# Altium project ACSR-RC-V2.0.PrjPcb
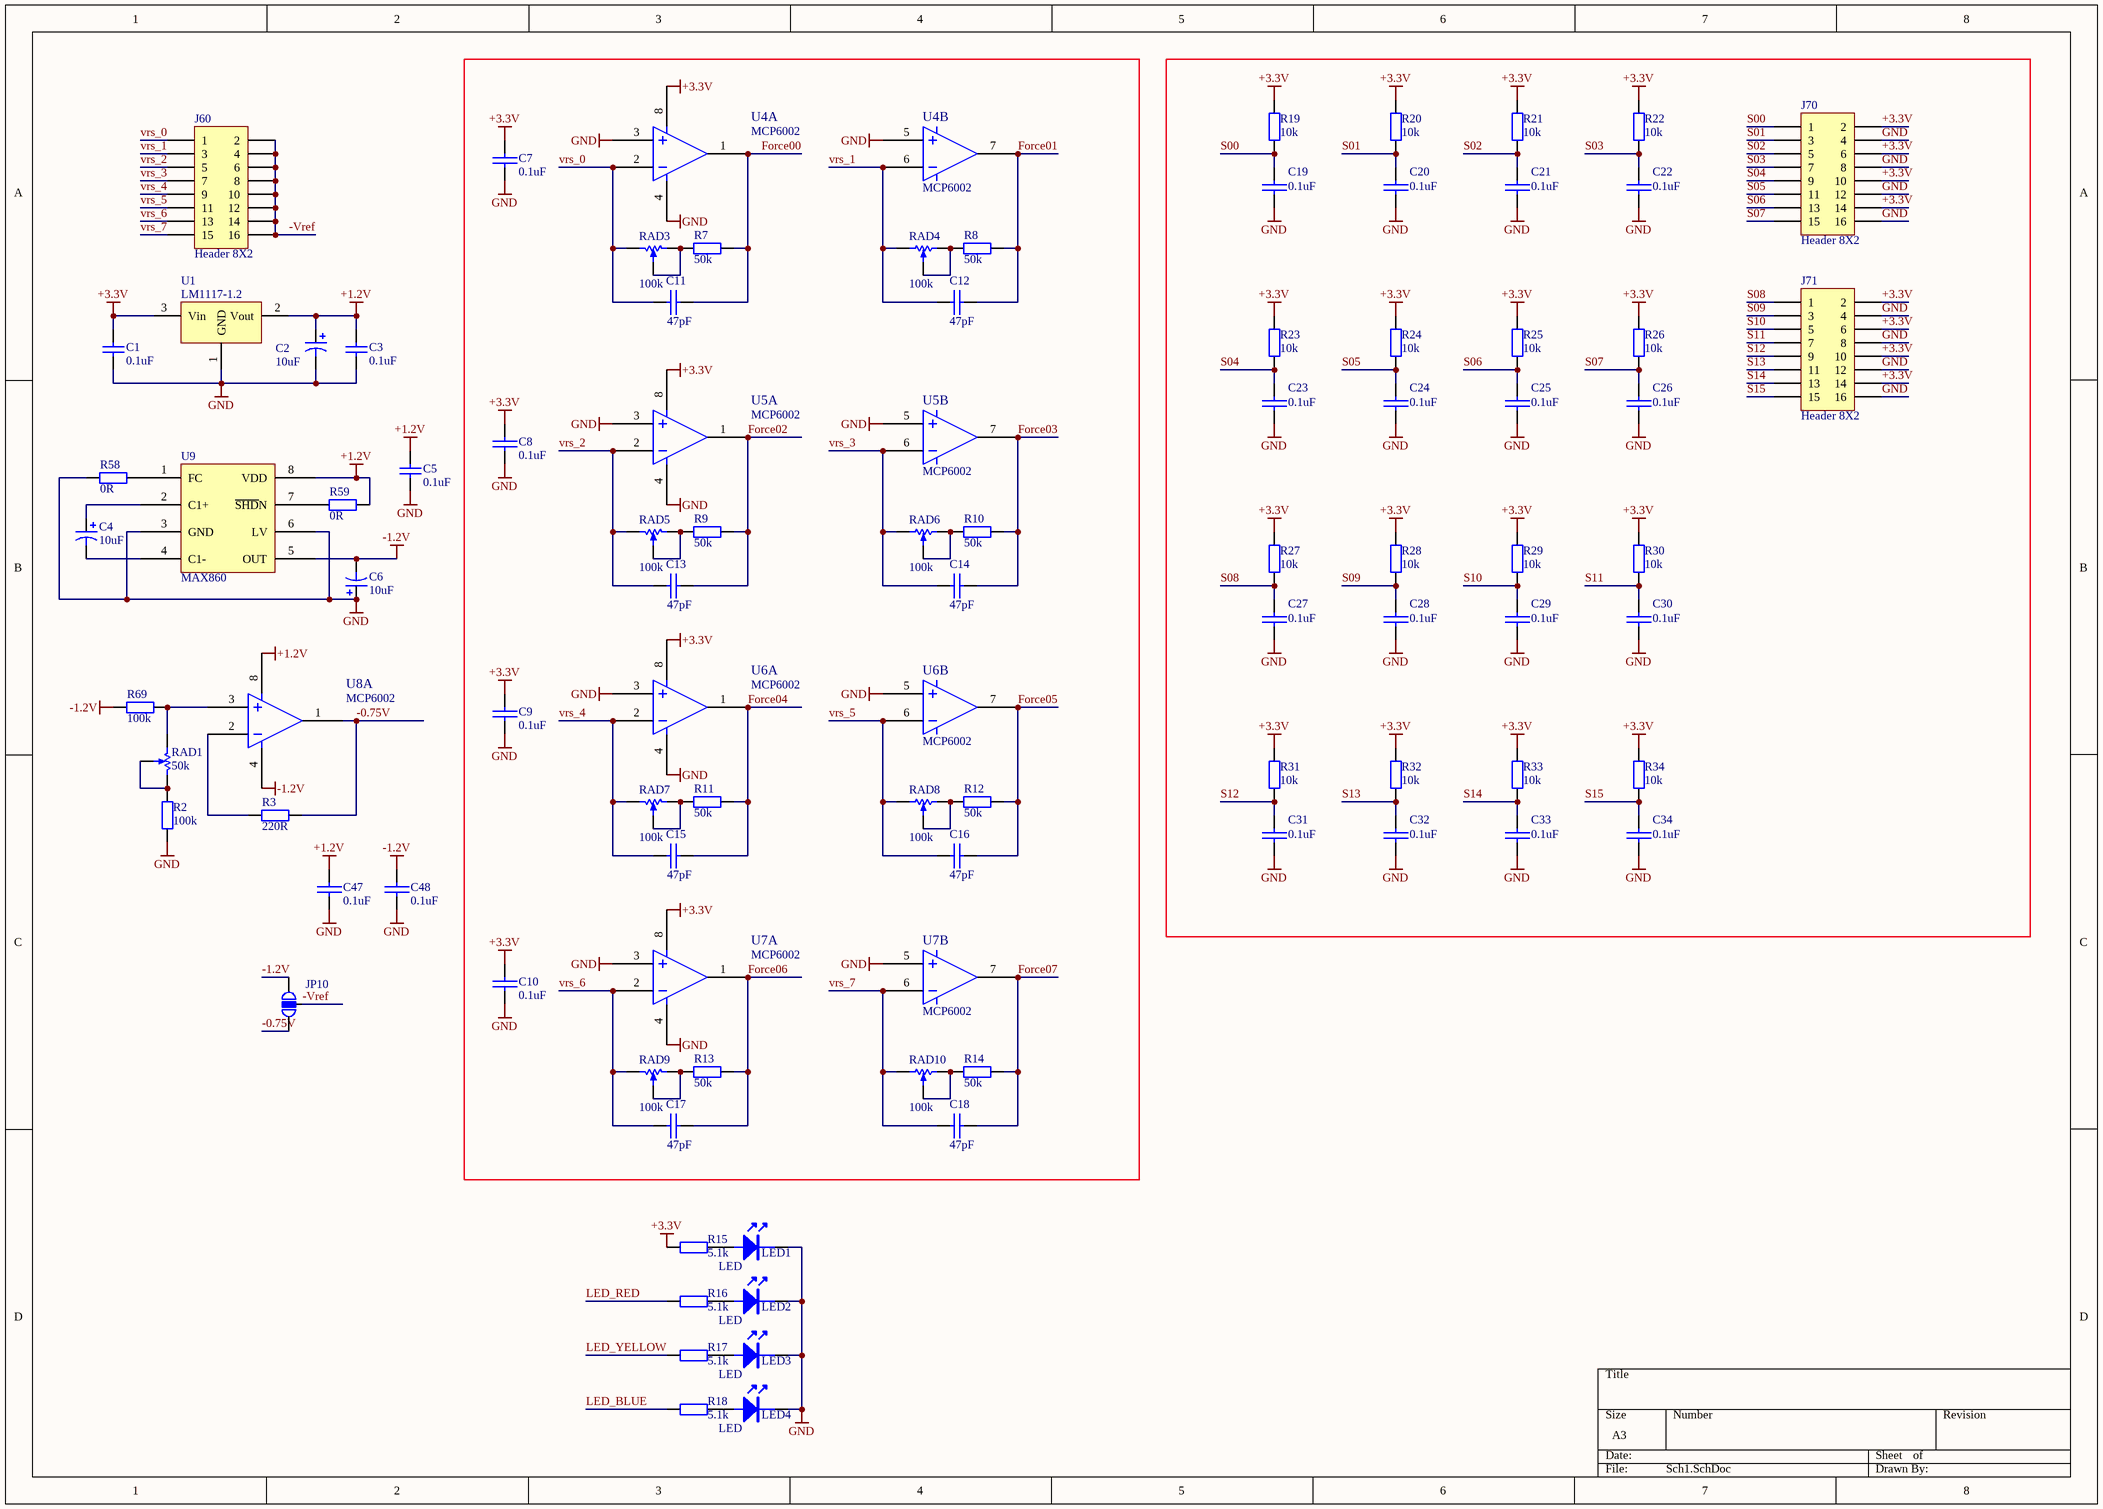
[diagram p0: Sch1.SchDoc]
3 sheets, 207 parts. Net scope: global (net labels, ports and power ports of the same name join across sheets).
Board file: ACSR-RC-V2.0.PcbDoc
Sheets:
  Sch1.SchDoc
  Sch3.SchDoc
  Sch2.SchDoc

## Sheet Sch1.SchDoc
size A3

### Parts
C1  value 0.1uF  [CC0603]  (hidden comment: 0603-50V-0.1uF)
C2  value 10uF  [SMD-EC-F5]  (hidden comment: CD-50V-10uF-F5(SMD))
C3  value 0.1uF  [CC0603]  (hidden comment: 0603-50V-0.1uF)
C4  value 10uF  [SMD-EC-F5]  (hidden comment: CD-50V-10uF-F5(SMD))
C5  value 0.1uF  [CC0603]  (hidden comment: 0603-50V-0.1uF)
C6  value 10uF  [SMD-EC-F5]  (hidden comment: CD-50V-10uF-F5(SMD))
C7  value 0.1uF  [CC0603]  (hidden comment: 0603-50V-0.1uF)
C8  value 0.1uF  [CC0603]  (hidden comment: 0603-50V-0.1uF)
C9  value 0.1uF  [CC0603]  (hidden comment: 0603-50V-0.1uF)
C10  value 0.1uF  [CC0603]  (hidden comment: 0603-50V-0.1uF)
C11  value 47pF  [CC0603]  (hidden comment: 0603-50V-47pF)
C12  value 47pF  [CC0603]  (hidden comment: 0603-50V-47pF)
C13  value 47pF  [CC0603]  (hidden comment: 0603-50V-47pF)
C14  value 47pF  [CC0603]  (hidden comment: 0603-50V-47pF)
C15  value 47pF  [CC0603]  (hidden comment: 0603-50V-47pF)
C16  value 47pF  [CC0603]  (hidden comment: 0603-50V-47pF)
C17  value 47pF  [CC0603]  (hidden comment: 0603-50V-47pF)
C18  value 47pF  [CC0603]  (hidden comment: 0603-50V-47pF)
C19  value 0.1uF  [CC0603]  (hidden comment: 0603-50V-0.1uF)
C20  value 0.1uF  [CC0603]  (hidden comment: 0603-50V-0.1uF)
C21  value 0.1uF  [CC0603]  (hidden comment: 0603-50V-0.1uF)
C22  value 0.1uF  [CC0603]  (hidden comment: 0603-50V-0.1uF)
C23  value 0.1uF  [CC0603]  (hidden comment: 0603-50V-0.1uF)
C24  value 0.1uF  [CC0603]  (hidden comment: 0603-50V-0.1uF)
C25  value 0.1uF  [CC0603]  (hidden comment: 0603-50V-0.1uF)
C26  value 0.1uF  [CC0603]  (hidden comment: 0603-50V-0.1uF)
C27  value 0.1uF  [CC0603]  (hidden comment: 0603-50V-0.1uF)
C28  value 0.1uF  [CC0603]  (hidden comment: 0603-50V-0.1uF)
C29  value 0.1uF  [CC0603]  (hidden comment: 0603-50V-0.1uF)
C30  value 0.1uF  [CC0603]  (hidden comment: 0603-50V-0.1uF)
C31  value 0.1uF  [CC0603]  (hidden comment: 0603-50V-0.1uF)
C32  value 0.1uF  [CC0603]  (hidden comment: 0603-50V-0.1uF)
C33  value 0.1uF  [CC0603]  (hidden comment: 0603-50V-0.1uF)
C34  value 0.1uF  [CC0603]  (hidden comment: 0603-50V-0.1uF)
C47  value 0.1uF  [CC0603]  (hidden comment: 0603-50V-0.1uF)
C48  value 0.1uF  [CC0603]  (hidden comment: 0603-50V-0.1uF)
J60  Header 8X2  [HDR2X8]
J70  Header 8X2  [HDR2X8]
J71  Header 8X2  [HDR2X8]
JP10  Jumper  [HDR1X3]  (value not drawn)
LED1  value LED  [LED-R3]  (hidden comment: LED-φ3(翠绿))
LED2  value LED  [LED-R3]  (hidden comment: LED-φ3(红))
LED3  value LED  [LED-R3]  (hidden comment: LED-φ3(黄))
LED4  value LED  [LED-R3]  (hidden comment: LED-φ3(蓝))
R2  value 100k  [0603]  (hidden comment: 0603-100kΩ±1％)
R3  value 220R  [0603]  (hidden comment: 0603-220Ω±1％)
R7  value 50k  [0603]  (hidden comment: 0603-50kΩ±1％)
R8  value 50k  [0603]  (hidden comment: 0603-50kΩ±1％)
R9  value 50k  [0603]  (hidden comment: 0603-50kΩ±1％)
R10  value 50k  [0603]  (hidden comment: 0603-50kΩ±1％)
R11  value 50k  [0603]  (hidden comment: 0603-50kΩ±1％)
R12  value 50k  [0603]  (hidden comment: 0603-50kΩ±1％)
R13  value 50k  [0603]  (hidden comment: 0603-50kΩ±1％)
R14  value 50k  [0603]  (hidden comment: 0603-50kΩ±1％)
R15  value 5.1k  [0603]  (hidden comment: 0603-5.1kΩ±1％)
R16  value 5.1k  [0603]  (hidden comment: 0603-5.1kΩ±1％)
R17  value 5.1k  [0603]  (hidden comment: 0603-5.1kΩ±1％)
R18  value 5.1k  [0603]  (hidden comment: 0603-5.1kΩ±1％)
R19  value 10k  [0603]  (hidden comment: 0603-10kΩ±1％)
R20  value 10k  [0603]  (hidden comment: 0603-10kΩ±1％)
R21  value 10k  [0603]  (hidden comment: 0603-10kΩ±1％)
R22  value 10k  [0603]  (hidden comment: 0603-10kΩ±1％)
R23  value 10k  [0603]  (hidden comment: 0603-10kΩ±1％)
R24  value 10k  [0603]  (hidden comment: 0603-10kΩ±1％)
R25  value 10k  [0603]  (hidden comment: 0603-10kΩ±1％)
R26  value 10k  [0603]  (hidden comment: 0603-10kΩ±1％)
R27  value 10k  [0603]  (hidden comment: 0603-10kΩ±1％)
R28  value 10k  [0603]  (hidden comment: 0603-10kΩ±1％)
R29  value 10k  [0603]  (hidden comment: 0603-10kΩ±1％)
R30  value 10k  [0603]  (hidden comment: 0603-10kΩ±1％)
R31  value 10k  [0603]  (hidden comment: 0603-10kΩ±1％)
R32  value 10k  [0603]  (hidden comment: 0603-10kΩ±1％)
R33  value 10k  [0603]  (hidden comment: 0603-10kΩ±1％)
R34  value 10k  [0603]  (hidden comment: 0603-10kΩ±1％)
R58  value 0R  [0603]  (hidden comment: 0603-0Ω±1％)
R59  value 0R  [0603]  (hidden comment: 0603-0Ω±1％)
R69  value 100k  [0603]  (hidden comment: 0603-100kΩ±1％)
RAD1  value 50k  [3224W]  (hidden comment: 3224W-50k)
RAD3  value 100k  [3224W]  (hidden comment: 3224W-100k)
RAD4  value 100k  [3224W]  (hidden comment: 3224W-100k)
RAD5  value 100k  [3224W]  (hidden comment: 3224W-100k)
RAD6  value 100k  [3224W]  (hidden comment: 3224W-100k)
RAD7  value 100k  [3224W]  (hidden comment: 3224W-100k)
RAD8  value 100k  [3224W]  (hidden comment: 3224W-100k)
RAD9  value 100k  [3224W]  (hidden comment: 3224W-100k)
RAD10  value 100k  [3224W]  (hidden comment: 3224W-100k)
U1  value LM1117-1.2  [SOT223]  (hidden comment: LM1117GS-1.2)
U4  MCP6002  [SO-8]  (parts A,B of 2)
U5  MCP6002  [SO-8]  (parts A,B of 2)
U6  MCP6002  [SO-8]  (parts A,B of 2)
U7  MCP6002  [SO-8]  (parts A,B of 2)
U8  MCP6002  [SO-8]  (part A of 2)
U9  max860  [SO-8]

### Nets
+1.2V: C2.1 C3.2 C5.2 C47.2 R59.2 U1.2(Vout) U8.8 U9.8(VDD)
+3.3V: C1.2 C7.2 C8.2 C9.2 C10.2 J70.2 J70.6 J70.10 J70.14 J71.2 J71.6 J71.10 J71.14 R15.2 R19.1 R20.1 R21.1 R22.1 R23.1 R24.1 R25.1 R26.1 R27.1 R28.1 R29.1 R30.1 R31.1 R32.1 R33.1 R34.1 U1.3(Vin) U4.8 U5.8 U6.8 U7.8
-1.2V: C6.2 C48.2 JP10.1(A) R69.2 U8.4 U9.5(OUT)
GND: C1.1 C2.2 C3.1 C5.1 C6.1 C7.1 C8.1 C9.1 C10.1 C19.2 C20.2 C21.2 C22.2 C23.2 C24.2 C25.2 C26.2 C27.2 C28.2 C29.2 C30.2 C31.2 C32.2 C33.2 C34.2 C47.1 C48.1 J70.4 J70.8 J70.12 J70.16 J71.4 J71.8 J71.12 J71.16 LED1.2 LED2.2 LED3.2 LED4.2 R2.1 R58.1 U1.1(GND) U4.3 U4.4 U4.5 U5.3 U5.4 U5.5 U6.3 U6.4 U6.5 U7.3 U7.4 U7.5 U9.3(GND) U9.6(LV)
-0.75V: JP10.3(B) R3.2 U8.1
-Vref: J60.2 J60.4 J60.6 J60.8 J60.10 J60.12 J60.14 J60.16 JP10.2(B)
Force00: C11.1 R7.2 U4.1
Force01: C12.1 R8.1 U4.7
Force02: C13.1 R9.2 U5.1
Force03: C14.1 R10.1 U5.7
Force04: C15.1 R11.2 U6.1
Force05: C16.1 R12.1 U6.7
Force06: C17.1 R13.2 U7.1
Force07: C18.1 R14.1 U7.7
LED_BLUE: R18.2
LED_RED: R16.2
LED_YELLOW: R17.2
S00: C19.1 J70.1 R19.2
S01: C20.1 J70.3 R20.2
S02: C21.1 J70.5 R21.2
S03: C22.1 J70.7 R22.2
S04: C23.1 J70.9 R23.2
S05: C24.1 J70.11 R24.2
S06: C25.1 J70.13 R25.2
S07: C26.1 J70.15 R26.2
S08: C27.1 J71.1 R27.2
S09: C28.1 J71.3 R28.2
S10: C29.1 J71.5 R29.2
S11: C30.1 J71.7 R30.2
S12: C31.1 J71.9 R31.2
S13: C32.1 J71.11 R32.2
S14: C33.1 J71.13 R33.2
S15: C34.1 J71.15 R34.2
vrs_0: C11.2 J60.1 RAD3.3(CW) U4.2
vrs_1: C12.2 J60.3 RAD4.1(CCW) U4.6
vrs_2: C13.2 J60.5 RAD5.3(CW) U5.2
vrs_3: C14.2 J60.7 RAD6.1(CCW) U5.6
vrs_4: C15.2 J60.9 RAD7.3(CW) U6.2
vrs_5: C16.2 J60.11 RAD8.1(CCW) U6.6
vrs_6: C17.2 J60.13 RAD9.3(CW) U7.2
vrs_7: C18.2 J60.15 RAD10.1(CCW) U7.6
NetC4_1: C4.1 U9.2(C1+)
NetC4_2: C4.2 U9.4(C1-)
NetLED1_1: LED1.1 R15.1
NetLED2_1: LED2.1 R16.1
NetLED3_1: LED3.1 R17.1
NetLED4_1: LED4.1 R18.1
NetR2_2: R2.2 RAD1.1(CCW) RAD1.2(W)
NetR3_1: R3.1 U8.2
NetR7_1: R7.1 RAD3.1(CCW) RAD3.2(W)
NetR8_2: R8.2 RAD4.2(W) RAD4.3(CW)
NetR9_1: R9.1 RAD5.1(CCW) RAD5.2(W)
NetR10_2: R10.2 RAD6.2(W) RAD6.3(CW)
NetR11_1: R11.1 RAD7.1(CCW) RAD7.2(W)
NetR12_2: R12.2 RAD8.2(W) RAD8.3(CW)
NetR13_1: R13.1 RAD9.1(CCW) RAD9.2(W)
NetR14_2: R14.2 RAD10.2(W) RAD10.3(CW)
NetR58_2: R58.2 U9.1(FC)
NetR59_1: R59.1 U9.7(~{SHD}N)
NetR69_1: R69.1 RAD1.3(CW) U8.3

### Library data of the parts
C1 C3 C5 = Cap: 贴片电容
C2 C4 C6 = Cap Pol1: 贴片铝电解电容
C7-C34 C47 C48 = CAP: 贴片电容
J60 J70 J71 = Header 8X2: 排针; Value: 2.54mm 2x8P双排针
JP10 = Bell: Value: 2.54mm 3P单排针
LED1-LED4 = LED: 发光二极管
R2 R3 R7-R14 R19-R34 R58 R59 R69 = Res2: 贴片电阻
R15-R18 = Res2: 贴片电阻器
RAD1 RAD3-RAD10 = RPot SM: 贴片电位器
U1 = 78: 三端稳压器
U4-U8 = 1458: 集成电路; Value: MCP6002
U9 = max860: 集成电路; Value: MAX860

## Sheet Sch3.SchDoc
size A3
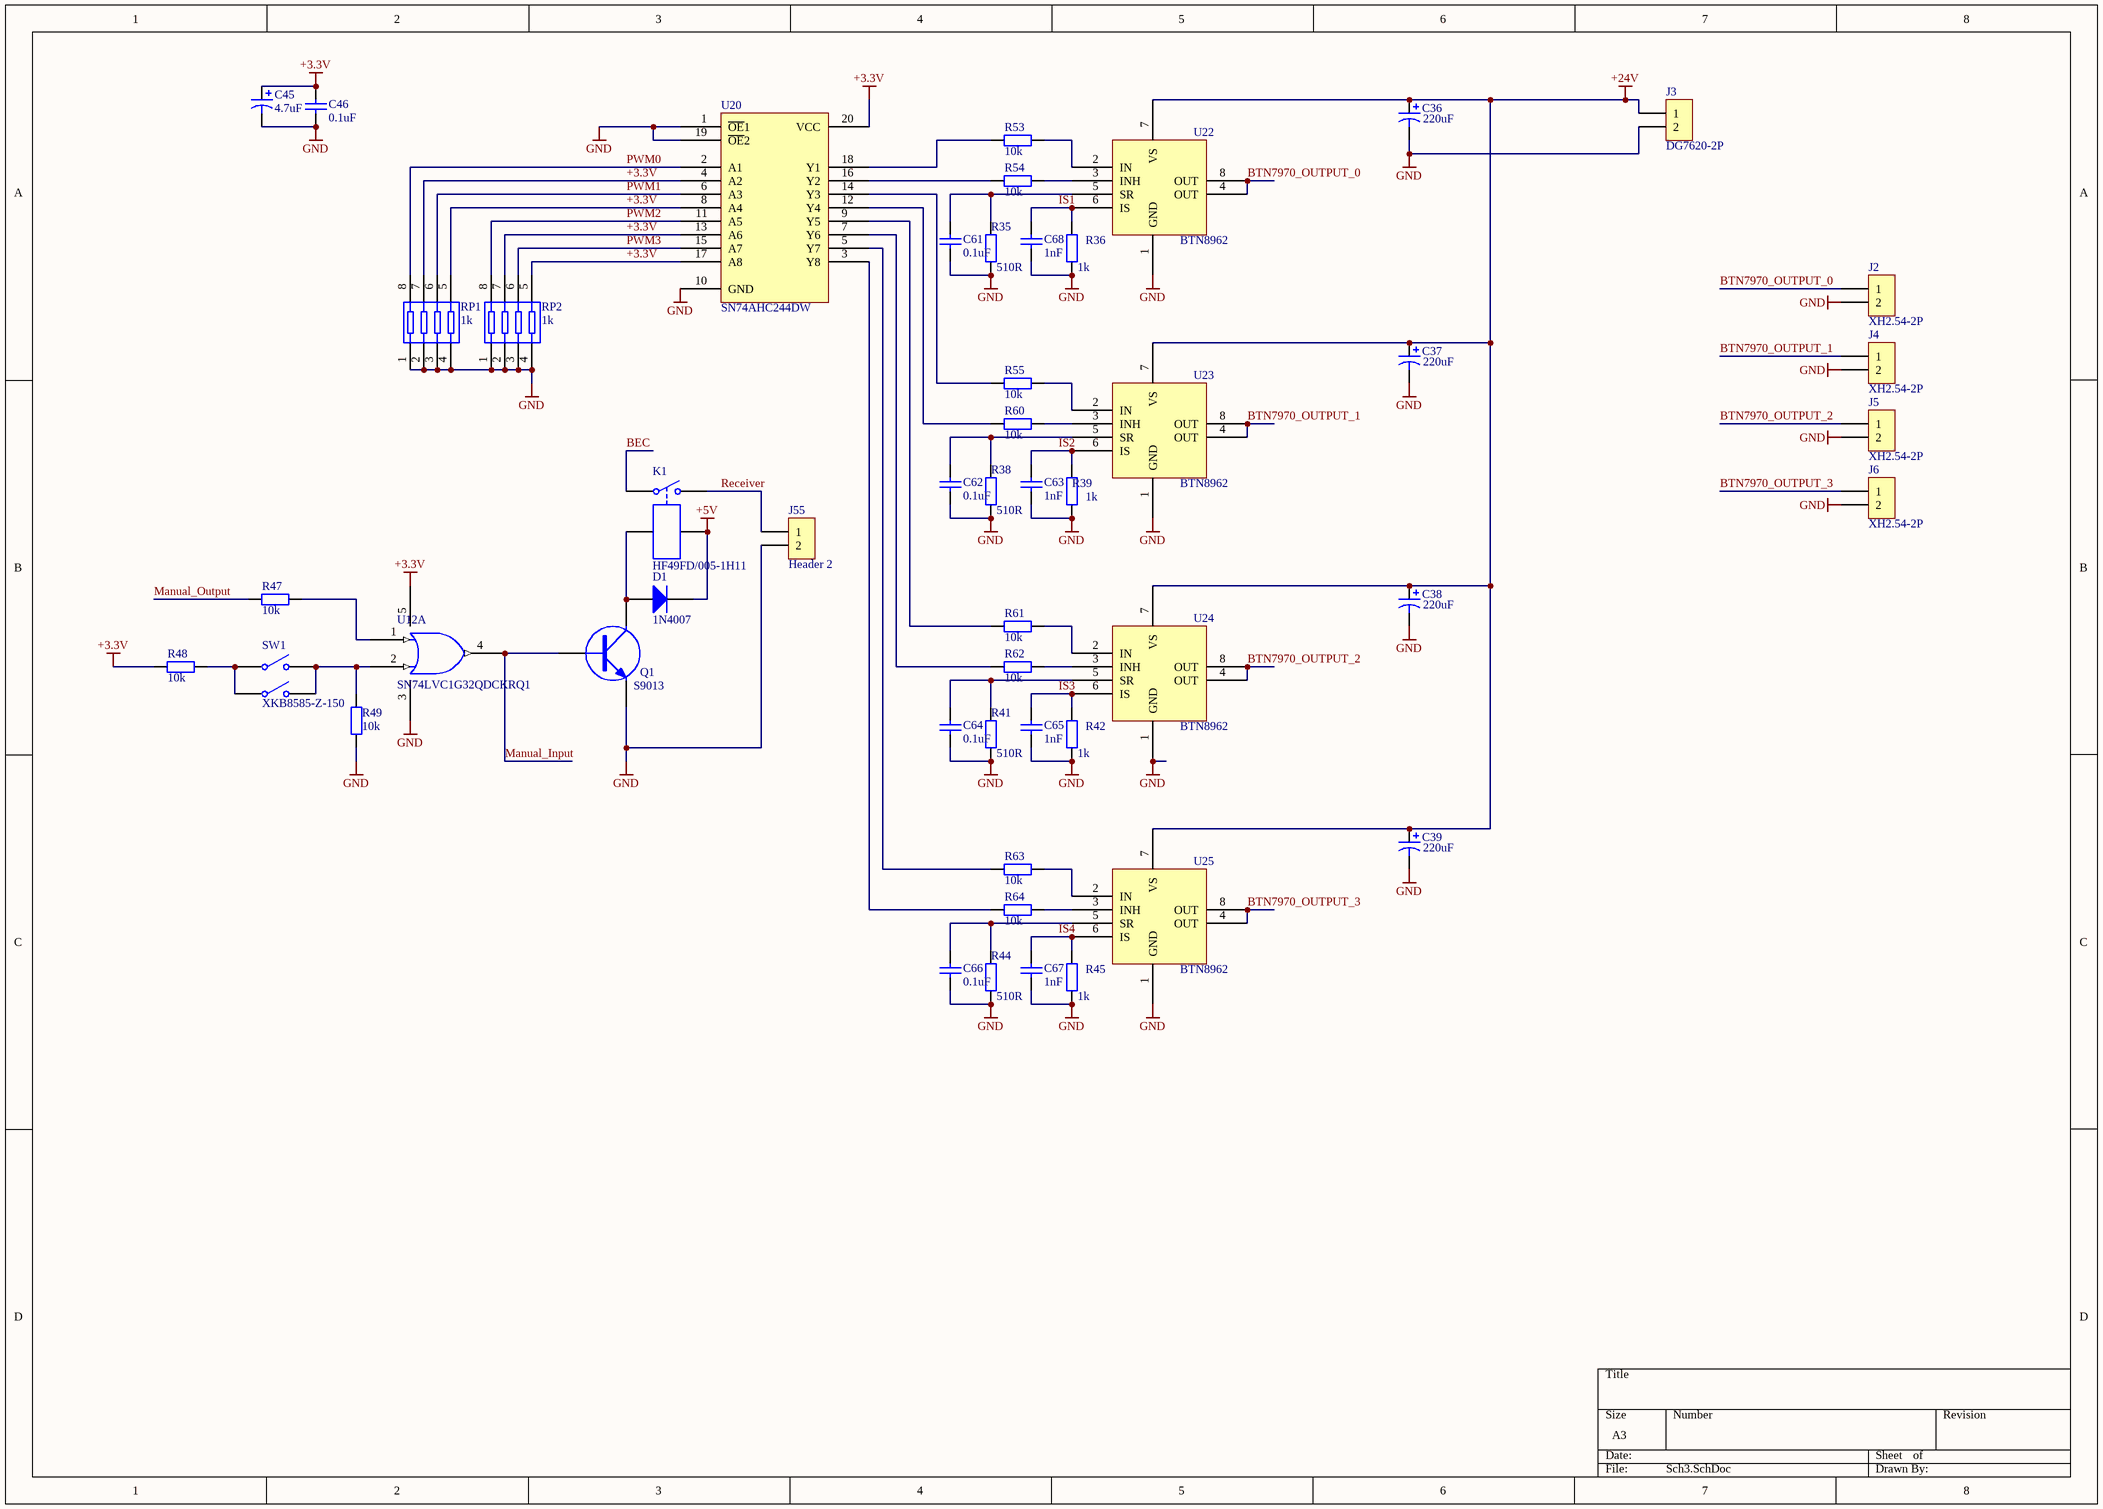
[diagram p1: Sch3.SchDoc]

### Parts
C36  value 220uF  [SMD-EC-F8]  (hidden comment: CD-50V-220uF-F8(SMD))
C37  value 220uF  [SMD-EC-F8]  (hidden comment: CD-50V-220uF-F8(SMD))
C38  value 220uF  [SMD-EC-F8]  (hidden comment: CD-50V-220uF-F8(SMD))
C39  value 220uF  [SMD-EC-F8]  (hidden comment: CD-50V-220uF-F8(SMD))
C45  value 4.7uF  [SMD-EC-F5]  (hidden comment: CD-50V-4.7uF-F5(SMD))
C46  value 0.1uF  [CC0603]  (hidden comment: 0603-50V-0.1uF)
C61  value 0.1uF  [CC0603]  (hidden comment: 0603-50V-0.1uF)
C62  value 0.1uF  [CC0603]  (hidden comment: 0603-50V-0.1uF)
C63  value 1nF  [CC0603]  (hidden comment: 0603-50V-1nF)
C64  value 0.1uF  [CC0603]  (hidden comment: 0603-50V-0.1uF)
C65  value 1nF  [CC0603]  (hidden comment: 0603-50V-1nF)
C66  value 0.1uF  [CC0603]  (hidden comment: 0603-50V-0.1uF)
C67  value 1nF  [CC0603]  (hidden comment: 0603-50V-1nF)
C68  value 1nF  [CC0603]  (hidden comment: 0603-50V-1nF)
D1  value 1N4007  [1N4007]  (hidden comment: 1N4007(SOD-123FL))
J2  XH2.54-2P  [XH2.54-2P]
J3  DG7620-2P  [DG7620-2P]
J4  XH2.54-2P  [XH2.54-2P]
J5  XH2.54-2P  [XH2.54-2P]
J6  XH2.54-2P  [XH2.54-2P]
J55  Header 2  [HDR1X2]
K1  HF49FD/005-1H11  [HF49FD]
Q1  value S9013  [SOT23]  (hidden comment: S9013(SOT-23))
R35  value 510R  [0603]  (hidden comment: 0603-510Ω±1％)
R36  value 1k  [0603]  (hidden comment: 0603-1kΩ±1％)
R38  value 510R  [0603]  (hidden comment: 0603-510Ω±1％)
R39  value 1k  [0603]  (hidden comment: 0603-1kΩ±1％)
R41  value 510R  [0603]  (hidden comment: 0603-510Ω±1％)
R42  value 1k  [0603]  (hidden comment: 0603-1kΩ±1％)
R44  value 510R  [0603]  (hidden comment: 0603-510Ω±1％)
R45  value 1k  [0603]  (hidden comment: 0603-1kΩ±1％)
R47  value 10k  [0603]  (hidden comment: 0603-10kΩ±1％)
R48  value 10k  [0603]  (hidden comment: 0603-10kΩ±1％)
R49  value 10k  [0603]  (hidden comment: 0603-10kΩ±1％)
R53  value 10k  [0603]  (hidden comment: 0603-10kΩ±1％)
R54  value 10k  [0603]  (hidden comment: 0603-10kΩ±1％)
R55  value 10k  [0603]  (hidden comment: 0603-10kΩ±1％)
R60  value 10k  [0603]  (hidden comment: 0603-10kΩ±1％)
R61  value 10k  [0603]  (hidden comment: 0603-10kΩ±1％)
R62  value 10k  [0603]  (hidden comment: 0603-10kΩ±1％)
R63  value 10k  [0603]  (hidden comment: 0603-10kΩ±1％)
R64  value 10k  [0603]  (hidden comment: 0603-10kΩ±1％)
RP1  value 1k  [RP8F]  (hidden comment: 0603-1kΩ-2*4P)
RP2  value 1k  [RP8F]  (hidden comment: 0603-1kΩ-2*4P)
SW1  XKB8585-Z-150  [KEY_SWITCH]
U12  SN74LVC1G32QDCKRQ1  [SC70-5]  (part A of 4)
U20  SN74AHC244DW  [SOP-20]
U22  BTN8962  [BTN7970]
U23  BTN8962  [BTN7970]
U24  BTN8962  [BTN7970]
U25  BTN8962  [BTN7970]

### Nets
+3.3V: C45.1 C46.2 R48.2 RP1.5 RP1.7 RP2.5 RP2.7 U12.5(VCC) U20.4(A2) U20.8(A4) U20.13(A6) U20.17(A8) U20.20(VCC)  [also labelled VCC]
+5V: D1.2(K) K1.2
+24V: C36.1 C37.1 C38.1 C39.1 J3.1 U22.7(VS) U23.7(VS) U24.7(VS) U25.7(VS)
GND: C36.2 C37.2 C38.2 C39.2 C45.2 C46.1 C61.1 C62.1 C63.1 C64.1 C65.1 C66.1 C67.1 C68.1 J2.2 J3.2 J4.2 J5.2 J6.2 J55.2 Q1.2(E) R35.1 R36.1 R38.1 R39.1 R41.1 R42.1 R44.1 R45.1 R49.2 RP1.1 RP1.2 RP1.3 RP1.4 RP2.1 RP2.2 RP2.3 RP2.4 U12.3(GND) U20.1(~{OE}1) U20.10(GND) U20.19(~{OE}2) U22.1(GND) U23.1(GND) U24.1(GND) U25.1(GND)
BEC: K1.3
BTN7970_OUTPUT_0: J2.1 U22.4(OUT) U22.8(OUT)
BTN7970_OUTPUT_1: J4.1 U23.4(OUT) U23.8(OUT)
BTN7970_OUTPUT_2: J5.1 U24.4(OUT) U24.8(OUT)
BTN7970_OUTPUT_3: J6.1 U25.4(OUT) U25.8(OUT)
IS1: C68.2 R36.2 U22.6(IS)
IS2: C63.2 R39.2 U23.6(IS)
IS3: C65.2 R42.2 U24.6(IS)
IS4: C67.2 R45.2 U25.6(IS)
Manual_Input: Q1.1(B) U12.4
Manual_Output: R47.2
PWM0: RP1.8 U20.2(A1)
PWM1: RP1.6 U20.6(A3)
PWM2: RP2.8 U20.11(A5)
PWM3: RP2.6 U20.15(A7)
Receiver: J55.1 K1.4
NetC61_2: C61.2 R35.2 U22.5(SR)
NetC62_2: C62.2 R38.2 U23.5(SR)
NetC64_2: C64.2 R41.2 U24.5(SR)
NetC66_2: C66.2 R44.2 U25.5(SR)
NetD1_1: D1.1(A) K1.1 Q1.3(C)
NetR47_1: R47.1 U12.1
NetR48_1: R48.1 SW1.1(COMMON) SW1.6(COMMON)
NetR49_1: R49.1 SW1.2(NO) SW1.5(NO) U12.2
NetR53_1: R53.1 U20.18(Y1)
NetR53_2: R53.2 U22.2(IN)
NetR54_1: R54.1 U20.16(Y2)
NetR54_2: R54.2 U22.3(INH)
NetR55_1: R55.1 U20.14(Y3)
NetR55_2: R55.2 U23.2(IN)
NetR60_1: R60.1 U20.12(Y4)
NetR60_2: R60.2 U23.3(INH)
NetR61_1: R61.1 U20.9(Y5)
NetR61_2: R61.2 U24.2(IN)
NetR62_1: R62.1 U20.7(Y6)
NetR62_2: R62.2 U24.3(INH)
NetR63_1: R63.1 U20.5(Y7)
NetR63_2: R63.2 U25.2(IN)
NetR64_1: R64.1 U20.3(Y8)
NetR64_2: R64.2 U25.3(INH)

### Library data of the parts
C36-C39 = Cap Pol3: 贴片铝电解电容
C45 = Cap Pol1: 贴片铝电解电容
C46 C61-C68 = Cap: 贴片电容
D1 = Diode: 贴片二极管
J2-J6 = CON2: 插座
  J2 J4-J6: Value: XH2.54-2P
  J3: Value: DG7620-2P
J55 = CON2: 排针; Value: 2.54mm 2P单排针
K1 = Relay-SPST: Single-Pole Single-Throw Relay; Value: HF49FD/005-1H11
Q1 = S9013: 贴片三极管
R35 R36 R38 R39 R41 R42 R44 R45 R47-R49 R53-R55 R60-R64 = Res2: 贴片电阻
RP1 RP2 = RESPACK: 排阻
SW1 = SW-SPST: 开关; Value: XKB8585-Z-150
U12 = 74LS32: 集成电路; Value: SN74LVC1G32QDCKRQ1
U20 = SN74AHC244DW: 集成电路; Value: SN74AHC244DW
U22-U25 = BTN7970: 集成电路
  U22: Value: BTN7970
  U23-U25: Value: BTN8962

## Sheet Sch2.SchDoc
size A3
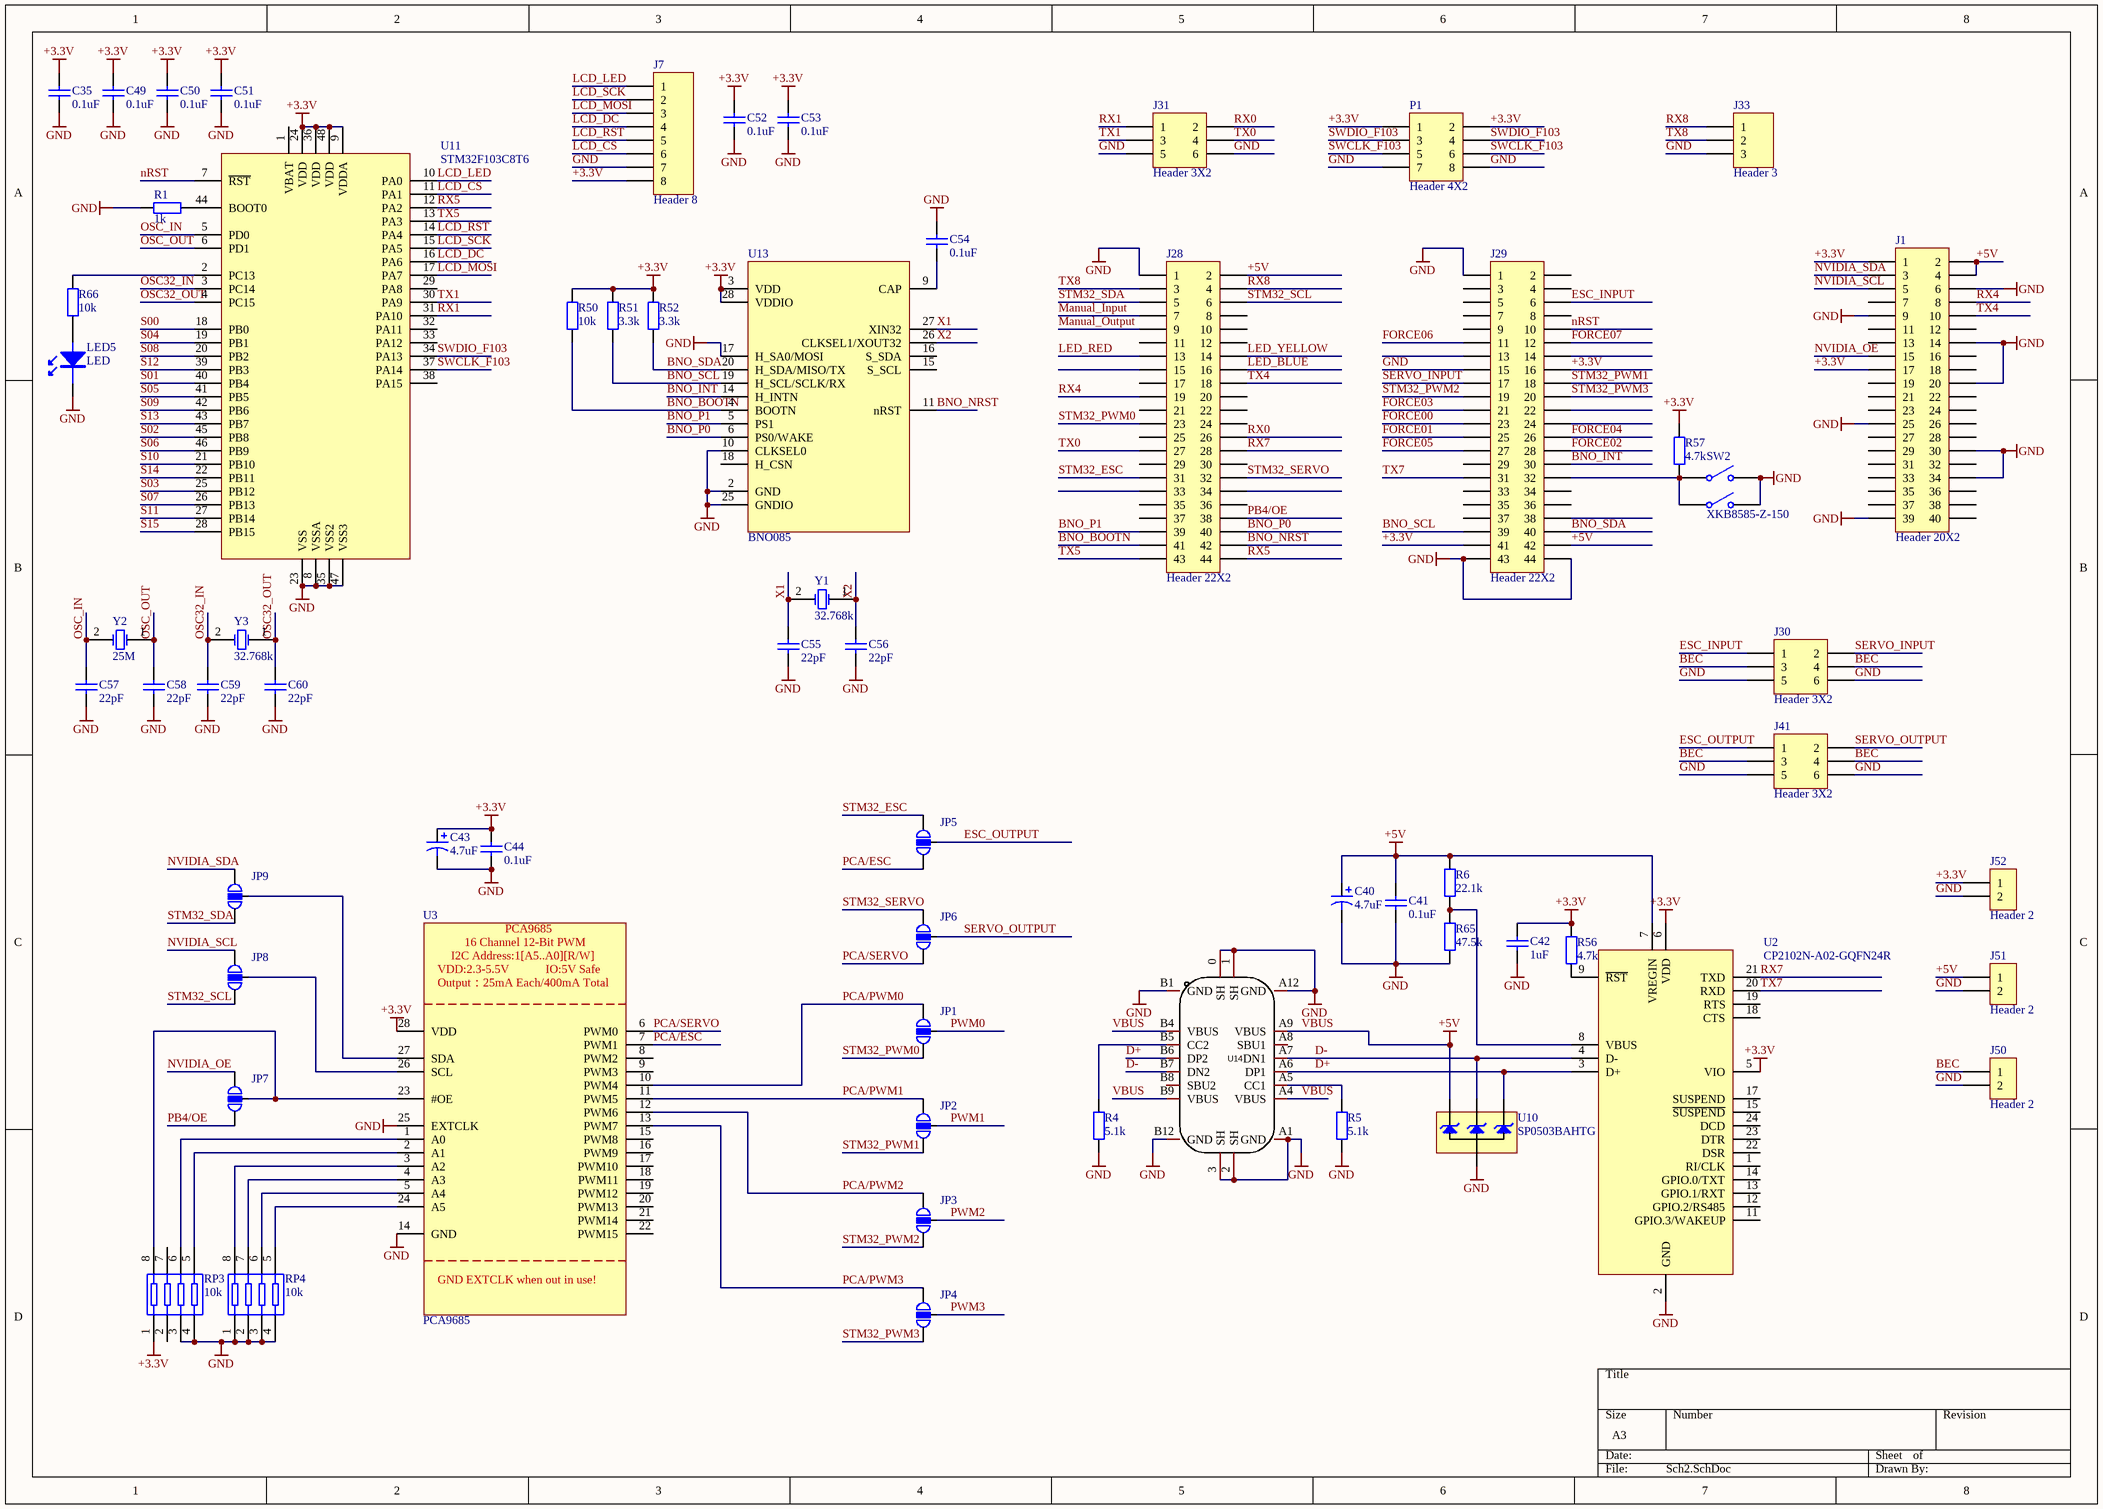
[diagram p2: Sch2.SchDoc]

### Parts
C35  value 0.1uF  [CC0603]  (hidden comment: 0603-50V-0.1uF)
C40  value 4.7uF  [SMD-EC-F5]  (hidden comment: CD-50V-4.7uF-F5(SMD))
C41  value 0.1uF  [CC0603]  (hidden comment: 0603-50V-0.1uF)
C42  value 1uF  [CC0603]  (hidden comment: 0603-50V-1uF)
C43  value 4.7uF  [SMD-EC-F5]  (hidden comment: CD-50V-4.7uF-F5(SMD))
C44  value 0.1uF  [CC0603]  (hidden comment: 0603-50V-0.1uF)
C49  value 0.1uF  [CC0603]  (hidden comment: 0603-50V-0.1uF)
C50  value 0.1uF  [CC0603]  (hidden comment: 0603-50V-0.1uF)
C51  value 0.1uF  [CC0603]  (hidden comment: 0603-50V-0.1uF)
C52  value 0.1uF  [CC0603]  (hidden comment: 0603-50V-0.1uF)
C53  value 0.1uF  [CC0603]  (hidden comment: 0603-50V-0.1uF)
C54  value 0.1uF  [CC0603]  (hidden comment: 0603-50V-0.1uF)
C55  value 22pF  [CC0603]  (hidden comment: 0603-50V-22pF)
C56  value 22pF  [CC0603]  (hidden comment: 0603-50V-22pF)
C57  value 22pF  [CC0603]  (hidden comment: 0603-50V-22pF)
C58  value 22pF  [CC0603]  (hidden comment: 0603-50V-22pF)
C59  value 22pF  [CC0603]  (hidden comment: 0603-50V-22pF)
C60  value 22pF  [CC0603]  (hidden comment: 0603-50V-22pF)
J1  Header 20X2  [HDR2X20]
J7  Header 8  [HDR1X8]
J28  Header 22X2  [HDR2X22]
J29  Header 22X2  [HDR2X22]
J30  Header 3X2  [HDR2X3]
J31  Header 3X2  [HDR2X3]
J33  Header 3  [HDR1X3]
J41  Header 3X2  [HDR2X3]
J50  Header 2  [HDR1X2]
J51  Header 2  [HDR1X2]
J52  Header 2  [HDR1X2]
JP1  Jumper  [HDR1X3]  (value not drawn)
JP2  Jumper  [HDR1X3]  (value not drawn)
JP3  Jumper  [HDR1X3]  (value not drawn)
JP4  Jumper  [HDR1X3]  (value not drawn)
JP5  Jumper  [HDR1X3]  (value not drawn)
JP6  Jumper  [HDR1X3]  (value not drawn)
JP7  Jumper  [HDR1X3]  (value not drawn)
JP8  Jumper  [HDR1X3]  (value not drawn)
JP9  Jumper  [HDR1X3]  (value not drawn)
LED5  value LED  [LED0603]  (hidden comment: 0603-LED-(蓝))
P1  Header 4X2  [HDR2X4]
R1  value 1k  [0603]  (hidden comment: 0603-1kΩ±1％)
R4  value 5.1k  [0603]  (hidden comment: 0603-5.1kΩ±1％)
R5  value 5.1k  [0603]  (hidden comment: 0603-5.1kΩ±1％)
R6  value 22.1k  [0603]  (hidden comment: 0603-22.1kΩ±1％)
R50  value 10k  [0603]  (hidden comment: 0603-10kΩ±1％)
R51  value 3.3k  [0603]  (hidden comment: 0603-3.3kΩ±1％)
R52  value 3.3k  [0603]  (hidden comment: 0603-3.3kΩ±1％)
R56  value 4.7k  [0603]  (hidden comment: 0603-4.7kΩ±1％)
R57  value 4.7k  [0603]  (hidden comment: 0603-4.7kΩ±1％)
R65  value 47.5k  [0603]  (hidden comment: 0603-47.5kΩ±1％)
R66  value 10k  [0603]  (hidden comment: 0603-10kΩ±1％)
RP3  value 10k  [RP8F]  (hidden comment: 0603-10kΩ-2*4P)
RP4  value 10k  [RP8F]  (hidden comment: 0603-10kΩ-2*4P)
SW2  XKB8585-Z-150  [KEY_SWITCH]
U2  CP2102N-A02-GQFN24R  [QFN24]
U3  PCA9685  [TSSOP-28]
U10  SP0503BAHTG  [SOT143-4]
U11  STM32F103C8T6  [LQFP48]
U13  BNO085  [LGA28]
U14  TYPE-C-31-M-12  [USB-C_SMD-TYPE-C-31-M-12]  (value not drawn)
Y1  32.768k  [XTAL-FA135]
Y2  25M  [XT49M]
Y3  32.768k  [XTAL-FA135]

### Nets
+3.3V: C35.2 C42.2 C43.1 C44.2 C49.2 C50.2 C51.2 C52.2 C53.2 J1.1 J1.17 J7.8 J29.16 J29.41 J52.1 P1.1 P1.2 R50.2 R51.2 R52.2 R56.1 R57.1 RP3.1 U2.5(VIO) U2.6(VDD) U3.28(VDD) U11.9(VDDA) U11.24(VDD) U11.36(VDD) U11.48(VDD) U13.3(VDD) U13.28(VDDIO)
+5V: C40.1 C41.2 J1.2 J1.4 J28.2 J29.42 J51.1 R6.1 U2.7(VREGIN) U10.2(K) U14.A4(VBUS) U14.A9(VBUS) U14.B4(VBUS) U14.B9(VBUS)  [also labelled VBUS]
GND: C35.1 C40.2 C41.1 C42.1 C43.2 C44.1 C49.1 C50.1 C51.1 C52.1 C53.1 C54.2 C55.2 C56.2 C57.2 C58.2 C59.2 C60.2 J1.6 J1.9 J1.14 J1.20 J1.25 J1.30 J1.34 J1.39 J7.7 J28.1 J29.1 J29.15 J29.43 J29.44 J30.5 J30.6 J31.5 J31.6 J33.3 J41.5 J41.6 J50.2 J51.2 J52.2 LED5.2 P1.7 P1.8 R1.1 R4.1 R5.1 R65.2 RP3.3 RP3.4 RP4.1 RP4.2 RP4.3 RP4.4 SW2.2(NO) SW2.5(NO) U2.2(GND) U3.14(GND) U3.25(EXTCLK) U10.1(A) U11.8(VSSA) U11.23(VSS) U11.35(VSS2) U11.47(VSS3) U13.2(GND) U13.10(CLKSEL0) U13.17(H_SA0/MOSI) U13.25(GNDIO) U14.0(SH) U14.1(SH) U14.2(SH) U14.3(SH) U14.A1(GND) U14.A12(GND) U14.B1(GND) U14.B12(GND)
BEC: J30.3 J30.4 J41.3 J41.4 J50.1
BNO_BOOTN: J28.41 R50.1 U13.4(BOOTN)
BNO_INT: J29.30 U13.14(H_INTN)
BNO_NRST: J28.42 U13.11(nRST)
BNO_P0: J28.40 U13.6(PS0/WAKE)
BNO_P1: J28.39 U13.5(PS1)
BNO_SCL: J29.39 R51.1 U13.19(H_SCL/SCLK/RX)
BNO_SDA: J29.40 R52.1 U13.20(H_SDA/MISO/TX)
D+: U2.3(D+) U10.4(K) U14.A6(DP1) U14.B6(DP2)
D-: U2.4(D-) U10.3(K) U14.A7(DN1) U14.B7(DN2)
ESC_INPUT: J29.6 J30.1
ESC_OUTPUT: J41.1 JP5.2(B)
Force00: J29.23
Force01: J29.25
Force02: J29.28
Force03: J29.21
Force04: J29.26
Force05: J29.27
Force06: J29.11
Force07: J29.12
LCD_CS: J7.6 U11.11(PA1)
LCD_DC: J7.4 U11.16(PA6)
LCD_LED: J7.1 U11.10(PA0)
LCD_MOSI: J7.3 U11.17(PA7)
LCD_RST: J7.5 U11.14(PA4)
LCD_SCK: J7.2 U11.15(PA5)
LED_BLUE: J28.16
LED_RED: J28.13
LED_YELLOW: J28.14
Manual_Input: J28.7
Manual_Output: J28.9
nRST: J29.10 U11.7(~{RST})
NVIDIA_OE: J1.15 JP7.1(A)
NVIDIA_SCL: J1.5 JP8.1(A)
NVIDIA_SDA: J1.3 JP9.1(A)
OSC32_IN: C59.1 U11.3(PC14) Y3.2(OSC2)
OSC32_OUT: C60.1 U11.4(PC15) Y3.1(OSC1)
OSC_IN: C57.1 U11.5(PD0) Y2.2(OSC2)
OSC_OUT: C58.1 U11.6(PD1) Y2.1(OSC1)
PB4/OE: J28.38 JP7.3(B)
PCA/ESC: JP5.3(B) U3.7(PWM1)
PCA/PWM0: JP1.1(A) U3.10(PWM4)
PCA/PWM1: JP2.1(A) U3.11(PWM5)
PCA/PWM2: JP3.1(A) U3.12(PWM6)
PCA/PWM3: JP4.1(A) U3.13(PWM7)
PCA/SERVO: JP6.3(B) U3.6(PWM0)
PWM0: JP1.2(B)
PWM1: JP2.2(B)
PWM2: JP3.2(B)
PWM3: JP4.2(B)
RX0: J28.26 J31.2
RX1: J31.1 U11.31(PA10)
RX4: J1.8 J28.19
RX5: J28.44 U11.12(PA2)
RX7: J28.28 U2.21(TXD)
RX8: J28.4 J33.1
S00: U11.18(PB0)
S01: U11.40(PB4)
S02: U11.45(PB8)
S03: U11.25(PB12)
S04: U11.19(PB1)
S05: U11.41(PB5)
S06: U11.46(PB9)
S07: U11.26(PB13)
S08: U11.20(PB2)
S09: U11.42(PB6)
S10: U11.21(PB10)
S11: U11.27(PB14)
S12: U11.39(PB3)
S13: U11.43(PB7)
S14: U11.22(PB11)
S15: U11.28(PB15)
SERVO_INPUT: J29.17 J30.2
SERVO_OUTPUT: J41.2 JP6.2(B)
STM32_ESC: J28.31 JP5.1(A)
STM32_PWM0: J28.23 JP1.3(B)
STM32_PWM1: J29.18 JP2.3(B)
STM32_PWM2: J29.19 JP3.3(B)
STM32_PWM3: J29.20 JP4.3(B)
STM32_SCL: J28.6 JP8.3(B)
STM32_SDA: J28.5 JP9.3(B)
STM32_SERVO: J28.32 JP6.1(A)
SWCLK_F103: P1.5 P1.6 U11.37(PA14)
SWDIO_F103: P1.3 P1.4 U11.34(PA13)
TX0: J28.27 J31.4
TX1: J31.3 U11.30(PA9)
TX4: J1.10 J28.18
TX5: J28.43 U11.13(PA3)
TX7: J29.31 U2.20(RXD)
TX8: J28.3 J33.2
X1: C55.1 U13.27(XIN32) Y1.2(OSC2)
X2: C56.1 U13.26(CLKSEL1/XOUT32) Y1.1(OSC1)
NetC54_1: C54.1 U13.9(CAP)
NetJ29_32: J29.32 R57.2 SW2.1(COMMON) SW2.6(COMMON)
NetJP7_2: JP7.2(B) RP3.8 U3.23(#OE)
NetJP8_2: JP8.2(B) U3.26(SCL)
NetJP9_2: JP9.2(B) U3.27(SDA)
NetLED5_1: LED5.1 R66.1
NetR1_2: R1.2 U11.44(BOOT0)
NetR4_2: R4.2 U14.B5(CC2)
NetR5_2: R5.2 U14.A5(CC1)
NetR6_2: R6.2 R65.1 U2.8(VBUS)
NetR56_2: R56.2 U2.9(~{RST})
NetR66_2: R66.2 U11.2(PC13)
NetRP3_5: RP3.5 U3.2(A1)
NetRP3_6: RP3.6 U3.1(A0)
NetRP4_5: RP4.5 U3.24(A5)
NetRP4_6: RP4.6 U3.5(A4)
NetRP4_7: RP4.7 U3.4(A3)
NetRP4_8: RP4.8 U3.3(A2)

Not connected (* = marked no-connect by the designer): J1 7 11 12 13 16 18 19 21 22 23 24 26 27 28 29 31 32 33 35 36 37 38 40; J28 8 10 11 12 15 17 20 21 22 24 25 29 30 33 34 35 36 37; J29 2 3 4 5 7 8 9 13 14 22 24 29 33 34 35 36 37 38; RP3 2 7; U2 1(RI/CLK) 11(GPIO.3/WAKEUP) 12(GPIO.2/RS485) 13(GPIO.1/RXT) 14(GPIO.0/TXT) 15(~{SUSPEND}) 17(SUSPEND) 18(CTS) 19(RTS) 22(DSR) 23(DTR) 24(DCD); U3 8(PWM2) 9(PWM3) 15(PWM8) 16(PWM9) 17(PWM10) 18(PWM11) 19(PWM12) 20(PWM13) 21(PWM14) 22(PWM15); U11 1(VBAT) 29(PA8) 32(PA11) 33(PA12) 38(PA15); U13 15(S_SCL) 16(S_SDA) 18(H_CSN); U14 A8(SBU1) B8(SBU2)

### Notes on the sheet
- (in symbol PCA9685) 16 Channel 12-Bit PWM; I2C Address:1[A5..A0][R/W]; VDD:2.3-5.5V; IO:5V Safe; Output：25mA Each/400mA Total; GND EXTCLK when out in use!

### Library data of the parts
C35 C41 C42 C44 C49-C60 = Cap: 贴片电容
C40 C43 = Cap Pol1: 贴片铝电解电容
J1 = Header 20X2: 排针; Value: 2.54mm 2x8P双排针
J7 = Header 8: 排针; Value: 2.54mm 8P单排针
J28 J29 = Header 22X2: 排针; Value: 2.54mm 2x22P双排针
J30 J31 = Header 3X2: 排针; Value: 2.54mm 2x3P双排针
J33 = Header 3: 排针; Value: 2.54mm 3P单排针
J41 = Header 3X2: 排针; Value: 2.54mm 2x8P双排针
J50-J52 = CON2: 排针; Value: 2.54mm 2P单排针
JP1-JP9 = Bell: Value: 2.54mm 3P单排针
LED5 = LED: 发光二极管
P1 = Header 4X2: 排针; Value: 2.54mm 2x4P双排针
R1 R4-R6 R50-R52 R56 R57 R65 R66 = Res2: 贴片电阻
RP3 RP4 = RESPACK: 排阻
SW2 = SW-SPST: 开关; Value: XKB8585-Z-150
U2 = CP2102N-A02-GQFN24R: 集成电路; Value: CP2102N-A02-GQFN24R
U3 = PCA9685: 集成电路; Value: PCA9685
U10 = SP0503BAHTG: 集成电路; Value: SP0503BAHTG
U11 = STM32F103C8T6: 集成电路; Value: STM32F103C8T6
U13 = BNO080: 集成电路; Value: BNO085
U14 = TYPE-C-31-M-12: Manufacturer: 韩国韩荣; Add into BOM: yes; Connector Type: Type-C; Gender: 母座; Number of Contacts: 16P; Number of Ports: 1; Current Rating - Power (Max): 5A; Name: TYPE-C-31-M-12; Symbol: TYPE-C-31-M-12; Device: TYPE-C-31-M-12; LCSC Part Name: Type-C 母座; Supplier Part: C165948; Manufacturer Part: TYPE-C-31-M-12; Supplier Footprint: SMD; JLCPCB Part Class: Extended Part; Datasheet: https://atta.szlcsc.com/upload/public/pdf/source/20220525/466408E853115E789EDB0DDC29077C05.pdf; Supplier: LCSC; Convert to PCB: yes; Standard: -; Mounting Style: -; Contact Material: -; Contact Plating: -; Operating Temperature Range: -; Welding Temperature (Max): -
Y1-Y3 = XTAL: Crystal Oscillator; Published: 8-Jun-2000; LatestRevisionDate: 17-Jul-2002; LatestRevisionNote: Re-released for DXP Platform.; PackageReference: R38; Publisher: Altium Limited; PackageDescription: Crystal, Thru-Hole; 2 Leads; Body 3.1 x 8.2 mm (Dia.xH)

## Nets that join several sheets
+3.3V: Sch1 (35 pins), Sch3 (13 pins), Sch2 (32 pins)
+5V: Sch3 (D1.2 K1.2), Sch2 (14 pins)
GND: Sch1 (56 pins), Sch3 (46 pins), Sch2 (77 pins)
BEC: Sch3 (K1.3), Sch2 (5 pins)
Force00: Sch1 (C11.1 R7.2 U4.1), Sch2 (J29.23)
Force01: Sch1 (C12.1 R8.1 U4.7), Sch2 (J29.25)
Force02: Sch1 (C13.1 R9.2 U5.1), Sch2 (J29.28)
Force03: Sch1 (C14.1 R10.1 U5.7), Sch2 (J29.21)
Force04: Sch1 (C15.1 R11.2 U6.1), Sch2 (J29.26)
Force05: Sch1 (C16.1 R12.1 U6.7), Sch2 (J29.27)
Force06: Sch1 (C17.1 R13.2 U7.1), Sch2 (J29.11)
Force07: Sch1 (C18.1 R14.1 U7.7), Sch2 (J29.12)
LED_BLUE: Sch1 (R18.2), Sch2 (J28.16)
LED_RED: Sch1 (R16.2), Sch2 (J28.13)
LED_YELLOW: Sch1 (R17.2), Sch2 (J28.14)
Manual_Input: Sch3 (Q1.1 U12.4), Sch2 (J28.7)
Manual_Output: Sch3 (R47.2), Sch2 (J28.9)
PWM0: Sch3 (RP1.8 U20.2), Sch2 (JP1.2)
PWM1: Sch3 (RP1.6 U20.6), Sch2 (JP2.2)
PWM2: Sch3 (RP2.8 U20.11), Sch2 (JP3.2)
PWM3: Sch3 (RP2.6 U20.15), Sch2 (JP4.2)
S00: Sch1 (C19.1 J70.1 R19.2), Sch2 (U11.18)
S01: Sch1 (C20.1 J70.3 R20.2), Sch2 (U11.40)
S02: Sch1 (C21.1 J70.5 R21.2), Sch2 (U11.45)
S03: Sch1 (C22.1 J70.7 R22.2), Sch2 (U11.25)
S04: Sch1 (C23.1 J70.9 R23.2), Sch2 (U11.19)
S05: Sch1 (C24.1 J70.11 R24.2), Sch2 (U11.41)
S06: Sch1 (C25.1 J70.13 R25.2), Sch2 (U11.46)
S07: Sch1 (C26.1 J70.15 R26.2), Sch2 (U11.26)
S08: Sch1 (C27.1 J71.1 R27.2), Sch2 (U11.20)
S09: Sch1 (C28.1 J71.3 R28.2), Sch2 (U11.42)
S10: Sch1 (C29.1 J71.5 R29.2), Sch2 (U11.21)
S11: Sch1 (C30.1 J71.7 R30.2), Sch2 (U11.27)
S12: Sch1 (C31.1 J71.9 R31.2), Sch2 (U11.39)
S13: Sch1 (C32.1 J71.11 R32.2), Sch2 (U11.43)
S14: Sch1 (C33.1 J71.13 R33.2), Sch2 (U11.22)
S15: Sch1 (C34.1 J71.15 R34.2), Sch2 (U11.28)